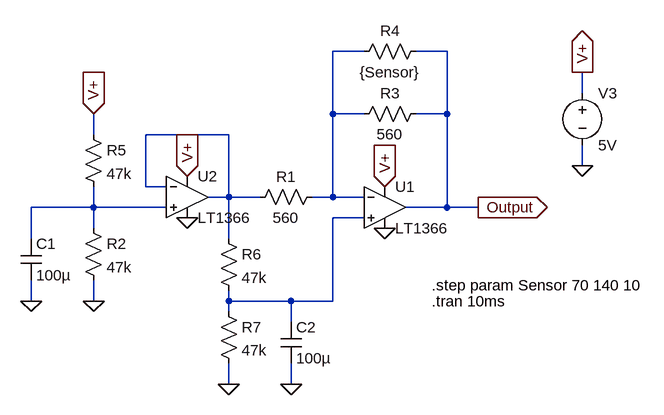
[diagram p0: schematic Hakko Temperature Sensor.asc]
Hakko Temperature Sensor.asc, the LTspice schematic file:
Version 4
SHEET 1 984 680
WIRE 144 -48 96 -48
WIRE 272 -48 224 -48
WIRE 480 16 480 -16
WIRE 96 48 96 -48
WIRE 144 48 96 48
WIRE 272 48 272 -48
WIRE 272 48 224 48
WIRE -272 80 -272 48
WIRE -64 80 -192 80
WIRE 480 128 480 96
WIRE -192 160 -192 80
WIRE -160 160 -192 160
WIRE -64 176 -64 80
WIRE -64 176 -96 176
WIRE -16 176 -64 176
WIRE 96 176 96 48
WIRE 96 176 64 176
WIRE 144 176 96 176
WIRE -272 192 -272 160
WIRE -272 192 -368 192
WIRE -160 192 -272 192
WIRE 272 192 272 48
WIRE 272 192 208 192
WIRE 320 192 272 192
WIRE 144 208 96 208
WIRE -272 224 -272 192
WIRE -368 240 -368 192
WIRE -64 240 -64 176
WIRE -368 336 -368 304
WIRE -272 336 -272 304
WIRE -64 336 -64 320
WIRE 32 336 -64 336
WIRE 96 336 96 208
WIRE 96 336 32 336
WIRE -64 352 -64 336
WIRE 32 368 32 336
WIRE -64 464 -64 432
WIRE 32 464 32 432
FLAG 176 224 0
FLAG 176 160 V+
IOPIN 176 160 In
FLAG -272 336 0
FLAG 320 192 Output
IOPIN 320 192 Out
FLAG 480 128 0
FLAG 480 -16 V+
IOPIN 480 -16 Out
FLAG -272 48 V+
IOPIN -272 48 In
FLAG -368 336 0
FLAG -128 208 0
FLAG -128 144 V+
IOPIN -128 144 In
FLAG -64 464 0
FLAG 32 464 0
SYMBOL Opamps\\LT1366 176 128 R0
SYMATTR InstName U1
SYMBOL res 80 160 R90
WINDOW 0 0 56 VBottom 2
WINDOW 3 32 56 VTop 2
SYMATTR InstName R1
SYMATTR Value 560
SYMBOL res 240 32 R90
WINDOW 0 0 56 VBottom 2
WINDOW 3 32 56 VTop 2
SYMATTR InstName R3
SYMATTR Value 560
SYMBOL res 240 -64 R90
WINDOW 0 0 56 VBottom 2
WINDOW 3 32 56 VTop 2
SYMATTR InstName R4
SYMATTR Value {Sensor}
SYMBOL voltage 480 0 R0
WINDOW 123 0 0 Left 2
WINDOW 39 0 0 Left 2
SYMATTR InstName V3
SYMATTR Value 5V
SYMBOL res -288 208 R0
SYMATTR InstName R2
SYMATTR Value 47k
SYMBOL res -288 64 R0
SYMATTR InstName R5
SYMATTR Value 47k
SYMBOL cap -384 240 R0
SYMATTR InstName C1
SYMATTR Value 100µ
SYMBOL Opamps\\LT1366 -128 112 R0
SYMATTR InstName U2
SYMBOL res -80 224 R0
SYMATTR InstName R6
SYMATTR Value 47k
SYMBOL res -80 336 R0
SYMATTR InstName R7
SYMATTR Value 47k
SYMBOL cap 16 368 R0
SYMATTR InstName C2
SYMATTR Value 100µ
TEXT 248 336 Left 2 !.tran 10ms
TEXT 248 312 Left 2 !.step param Sensor 70 140 10

The netlist it stands for:
* Hakko Temperature Sensor.asc
XU1 N004 N001 V+ 0 Output LT1366  ; pins In+ In- V+ V- OUT
R1 N001 N002 560
R3 Output N001 560
R4 Output N001 {Sensor}
V3 V+ 0 5V
R2 N003 0 47k
R5 V+ N003 47k
C1 N003 0 100µ
XU2 N003 N002 V+ 0 N002 LT1366  ; pins In+ In- V+ V- OUT
R6 N002 N004 47k
R7 N004 0 47k
C2 N004 0 100µ
.tran 10ms
.step param Sensor 70 140 10
.lib LTC.lib
.backanno
.end